# EAGLE design DRIVER (EAGLE 9.5.0)
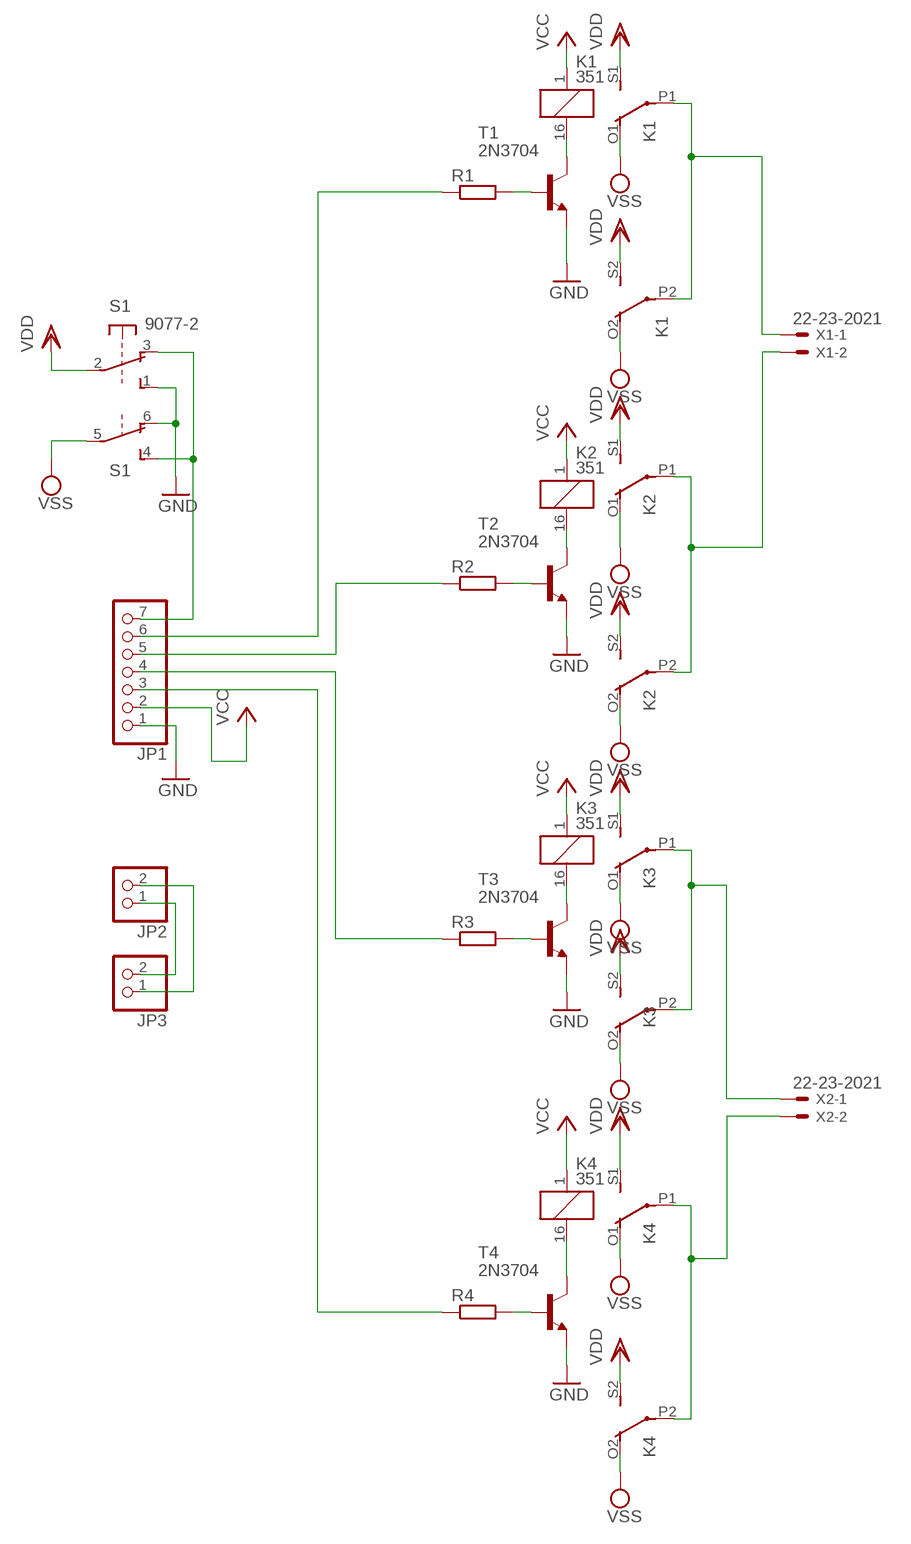
[diagram p0: schematic, sheet 1]

## Parts
JP1  PINHD-1X7  [1X07]
JP2  PINHD-1X2  [1X02]
JP3  PINHD-1X2  [1X02]
K1  351  [351]
K2  351  [351]
K3  351  [351]
K4  351  [351]
R1  R-EU_0207/7  [0207/7]
R2  R-EU_0207/7  [0207/7]
R3  R-EU_0207/7  [0207/7]
R4  R-EU_0207/7  [0207/7]
S1  9077-2  [9077-2]
T1  2N3704  [TO92]
T2  2N3704  [TO92]
T3  2N3704  [TO92]
T4  2N3704  [TO92]
X1  22-23-2021  [22-23-2021]
X2  22-23-2021  [22-23-2021]

## Nets
GND: JP1.1 S1.1(1:S) S1.6(2:O) T1.3(E) T2.3(E) T3.3(E) T4.3(E)
N$1: K1.16 T1.2(C)
N$2: K2.16 T2.2(C)
N$3: K4.16 T4.2(C)
N$4: K3.P1(2:P) K3.P2(3:P) X2.1
N$5: K4.P1(2:P) K4.P2(3:P) X2.2
N$6: K1.P1(2:P) K1.P2(3:P) X1.1
N$7: K2.P1(2:P) K2.P2(3:P) X1.2
N$8: JP1.5 R2.1
N$9: JP1.4 R3.1
N$10: JP1.3 R4.1
N$11: K3.16 T3.2(C)
N$12: R4.2 T4.1(B)
N$13: R3.2 T3.1(B)
N$14: R2.2 T2.1(B)
N$15: R1.2 T1.1(B)
N$16: JP1.6 R1.1
N$17: JP2.2 JP3.1
N$18: JP1.7 S1.3(1:O) S1.4(2:S)
N$19: JP2.1 JP3.2
VCC: JP1.2 K1.1 K2.1 K3.1 K4.1
VDD: K1.S1(2:S) K1.S2(3:S) K2.S1(2:S) K2.S2(3:S) K3.S1(2:S) K3.S2(3:S) K4.S1(2:S) K4.S2(3:S) S1.2(1:P)
VSS: K1.O1(2:O) K1.O2(3:O) K2.O1(2:O) K2.O2(3:O) K3.O1(2:O) K3.O2(3:O) K4.O1(2:O) K4.O2(3:O) S1.5(2:P)

## Library data of the parts
JP1 = pinhead:PINHD-1X7: PIN HEADER
JP2 JP3 = pinhead:PINHD-1X2: PIN HEADER
K1-K4 = relay:351: RELAY 2 x switch, Omron; OC_FARNELL: unknown; OC_NEWARK: unknown
R1-R4 = resistor:R-EU_: RESISTOR, European symbol
S1 = switch-misc:9077-2: MARQUARDT SWITCH 9077.0200 Distributor: Buerklin <https://www.buerklin.com/default.asp?event=ShowArtikel%2812G2822%29&l=d&jump=ArtNr_12G2822>
T1-T4 = transistor:2N3704: NPN TRANSISTOR
X1 X2 = con-molex:22-23-2021: .100" (2.54mm) Center Header - 2 Pin; MF: MOLEX; MPN: 22-23-2021; OC_FARNELL: 1462926; OC_NEWARK: 25C3832

## Board
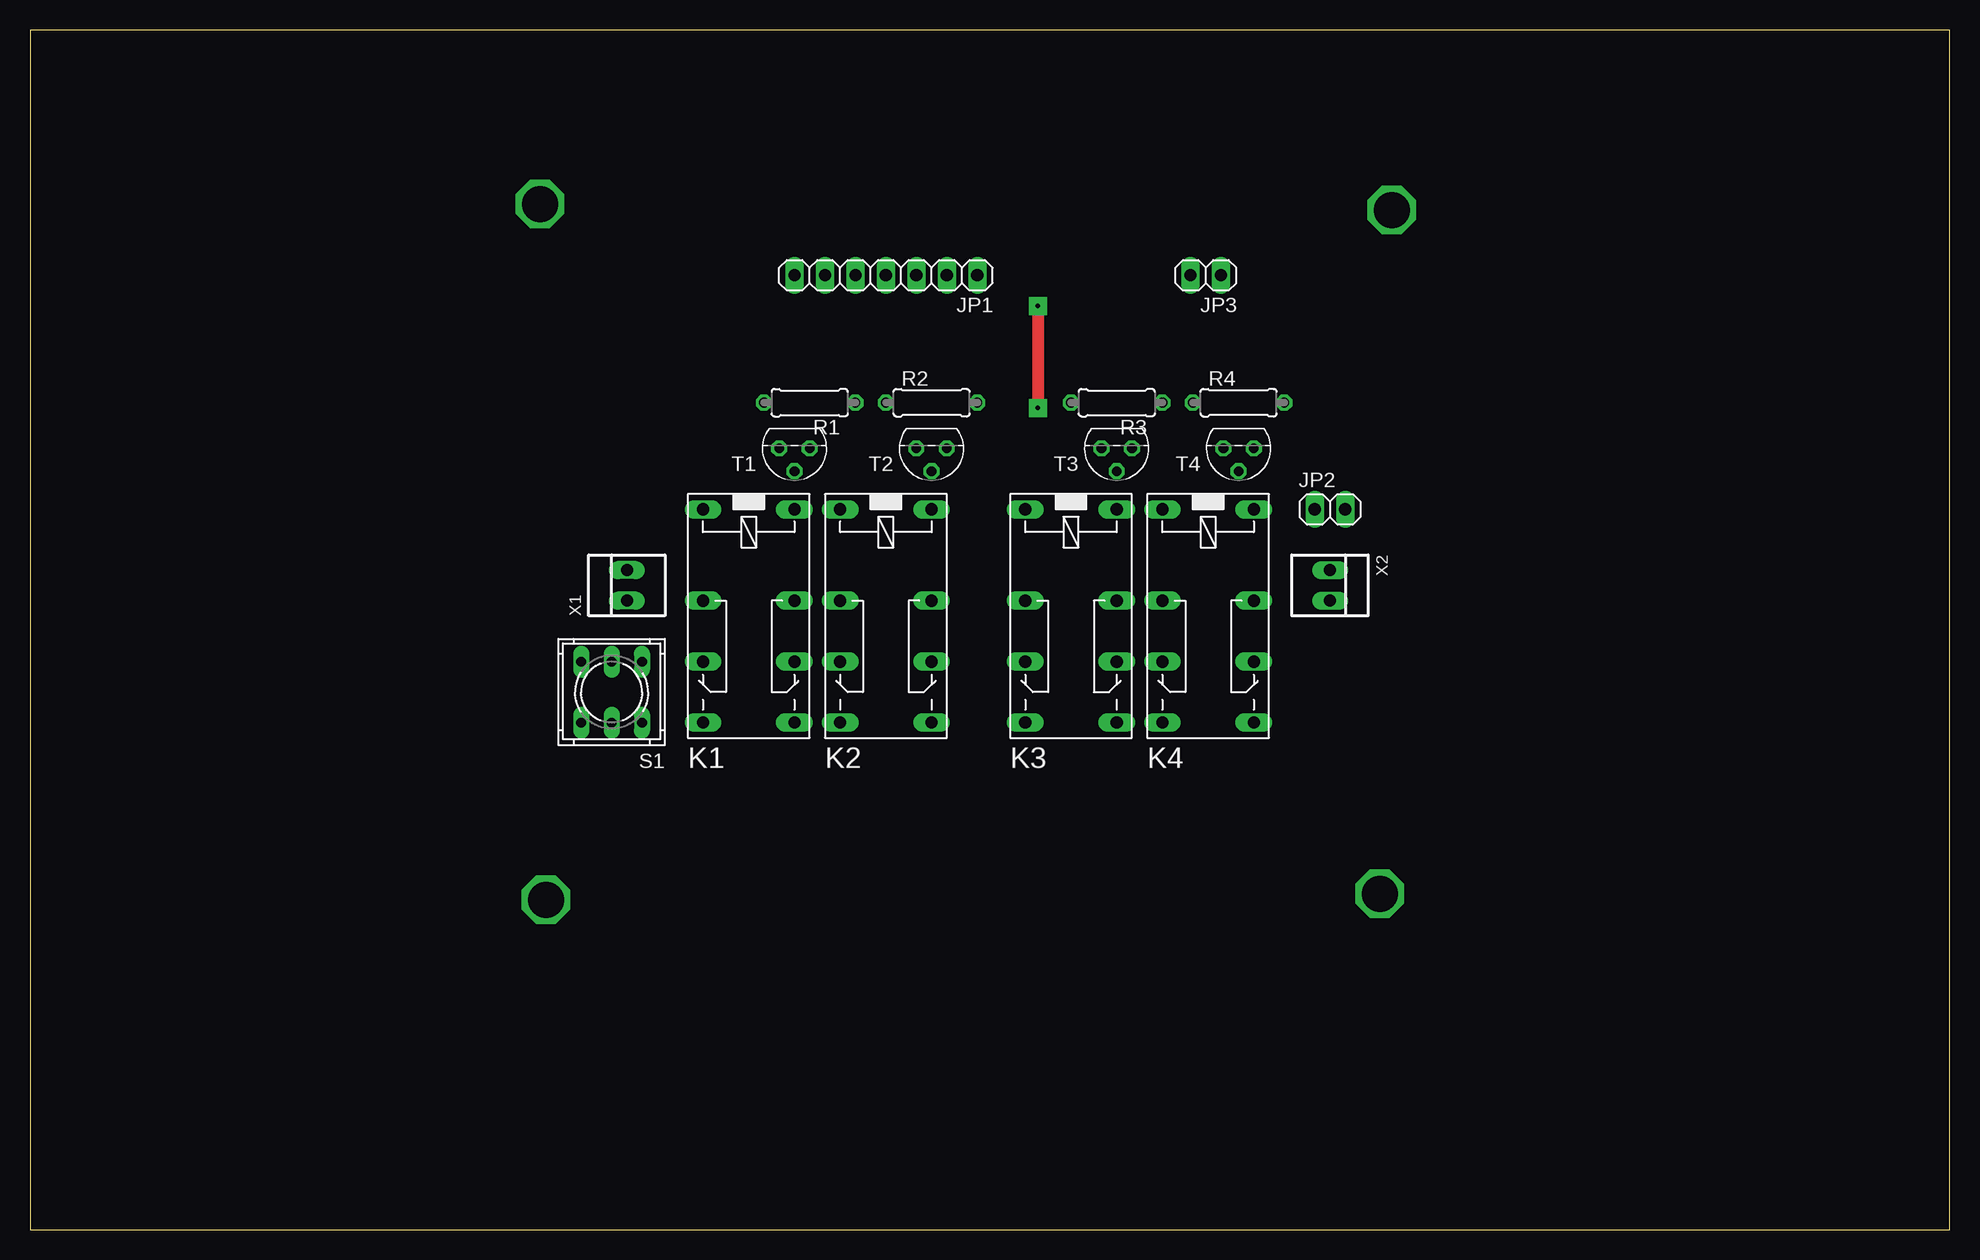
[diagram p1: board, top side]
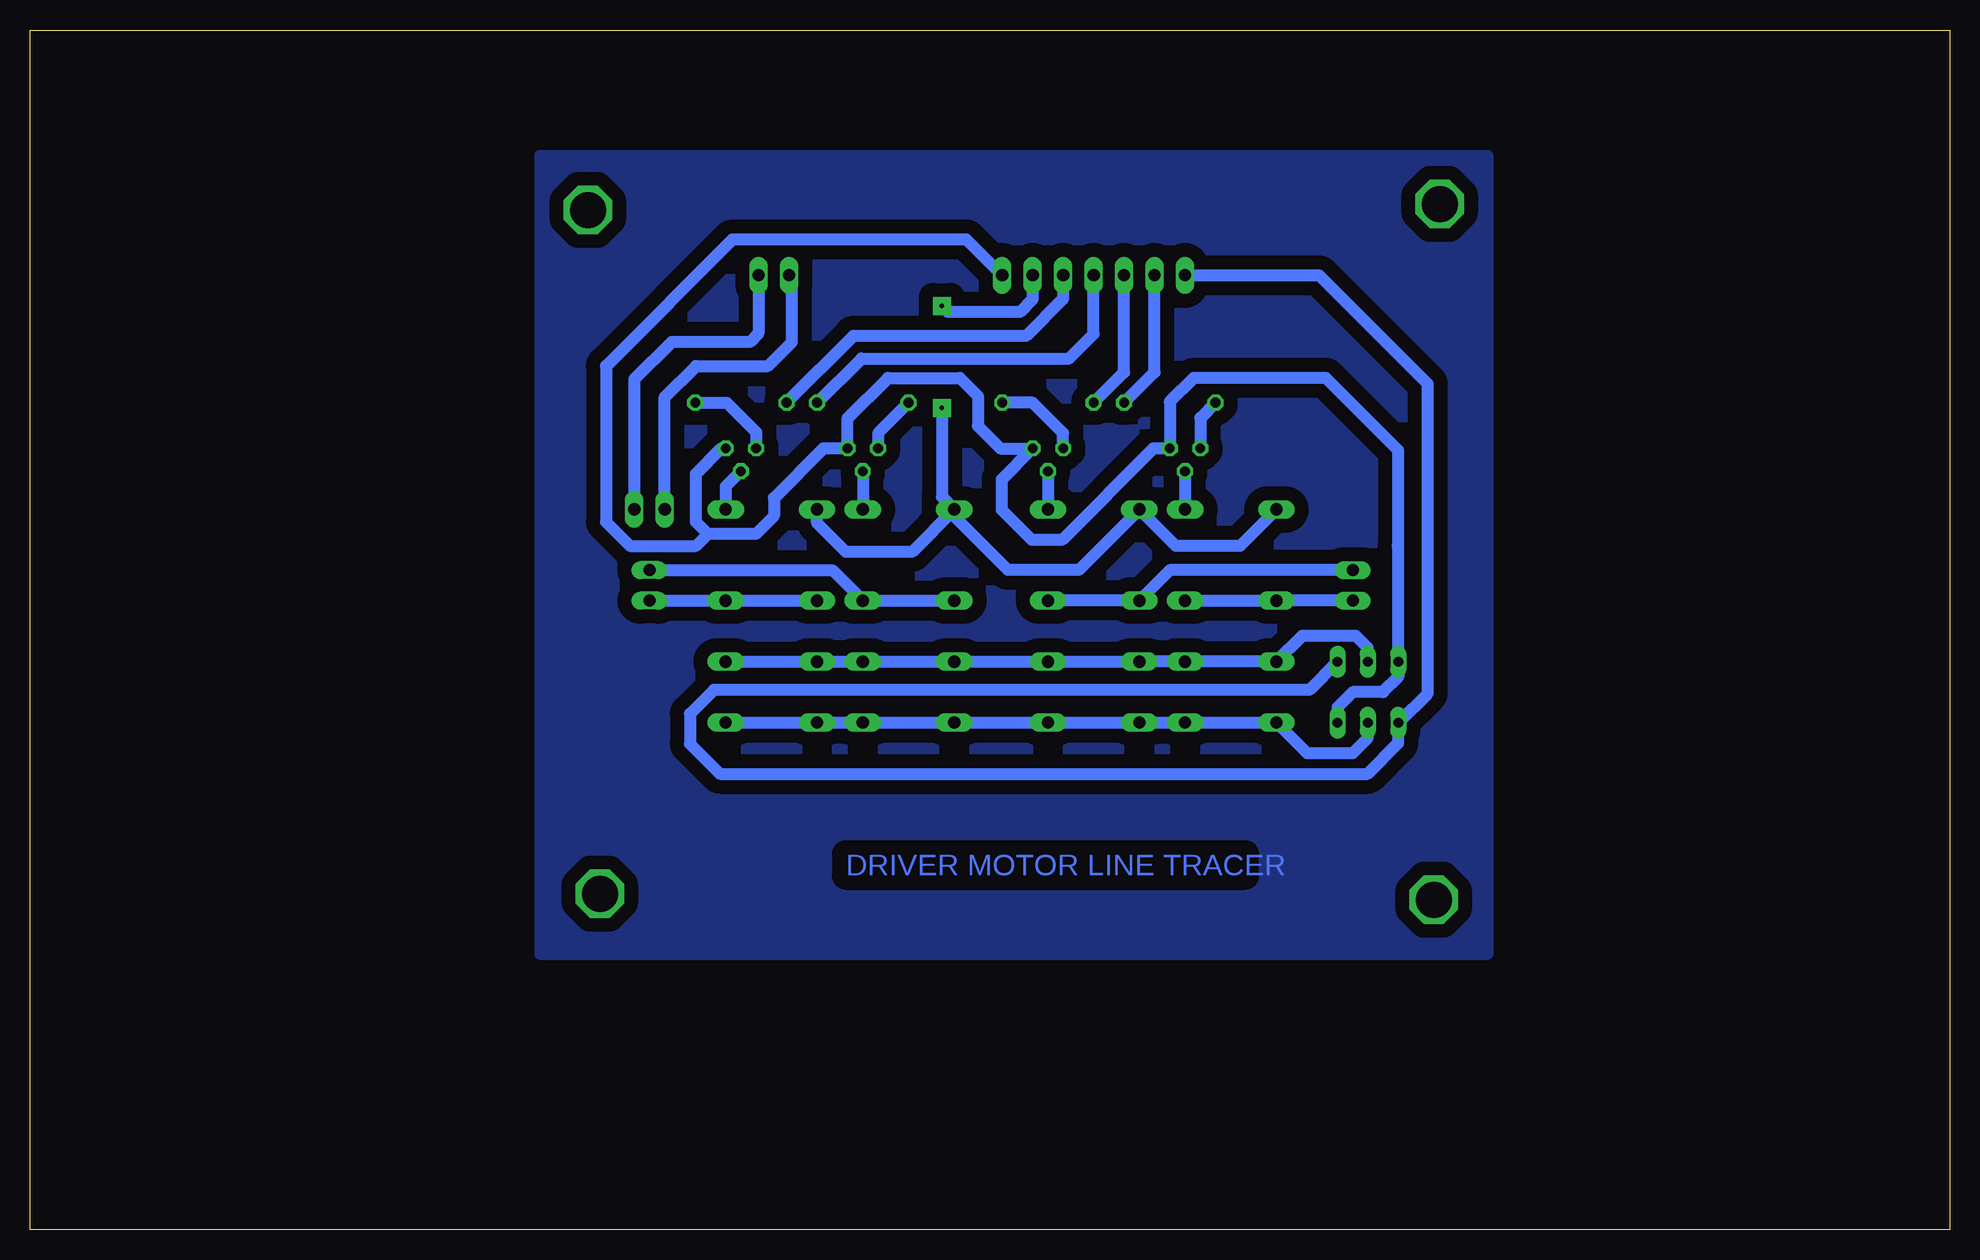
[diagram p2: board, bottom side, seen from below]

Size 160 x 100 mm. Coordinates in mm from the lower left corner, seen from the top.
Outline: 0,0 160,0 160,100 0,100 0,0
Copper layers (1*16): Top 0.035mm / dielectric 1.5mm / Bottom 0.035mm
Design rules "default *": minimum track width 6mil, minimum drill 0.35mm, track to track 46mil, track to pad 46mil, pad to pad 6mil, via to via 6mil, smd to smd 6mil, copper to edge 40mil, drill to drill 6mil, minimum pad ring 10mil, minimum via ring 8mil, stop-mask expansion 4mil, vias tented up to drill 0mil, thermal gap 10mil

### Footprints (pad centres in the part's own frame; a part is rotated, then mirrored left to right if it is on the bottom)
1X07 = drill 1.016 long: 1 -7.62,0; 2 -5.08,0; 3 -2.54,0; 4 0,0; 5 2.54,0; 6 5.08,0; 7 7.62,0
1X02 = drill 1.016 long: 1 -1.27,0; 2 1.27,0
351 = drill 1.016 long: 1 -3.81,-3.81; 16 -3.81,3.81; O1 8.89,-3.81; O2 8.89,3.81; P1 3.81,-3.81; P2 3.81,3.81; S1 13.97,-3.81; S2 13.97,3.81
0207/7 = drill 0.813 octagon: 1 -3.81,0; 2 3.81,0
9077-2 = drill 0.813 long: 1 -2.54,2.54; 2 0,2.54; 3 2.54,2.54; 4 -2.54,-2.54; 5 0,-2.54; 6 2.54,-2.54
TO92 = drill 0.813 octagon: 1 1.27,0; 2 0,1.905; 3 -1.27,0
22-23-2021 = drill 1 long: 1 -1.27,0; 2 1.27,0

### Placement (x,y rotation side)
JP1  71.34,79.55 180 top
JP2  108.36,60.04 0 top
JP3  98.01,79.55 180 top
K1  59.91,56.23 270 top
K2  71.34,56.23 270 top
K3  86.77,56.23 270 top
K4  98.2,56.23 270 top
R1  64.99,68.93 180 top
R2  75.15,68.93 0 top
R3  90.58,68.93 180 top
R4  100.74,68.93 0 top
S1  48.48,44.8 180 top
T1  63.72,65.12 180 top
T2  75.15,65.12 180 top
T3  90.58,65.12 180 top
T4  100.74,65.12 180 top
X1  49.75,53.69 90 top
X2  108.36,53.69 270 top

### Tracks (layer width: path | path; a pad name or v marks a point on that pad's centre or on a via)
GND
  Bottom 1: S1.1 51.02,43.53 49.75,44.8 47.21,44.8 45.94,46.07 S1.6 45.94,56.94 | 45.94,56.94 46,57 | 45.94,56.94 45.94,64.94 52,71 63,71 64.99,69.01 T1.3 66.38,65.12 74,57.5 76.5,57.5 79,60 79,62.54 T2.3 79.12,65.12 81,67 81,69.5 82.5,71 88.5,71 91.85,67.65 T3.3 93.88,65.12 98,61 98,59.5 99.5,58 103.5,58 | 103.5,58 104.5,59 104.5,63 102.38,65.12 T4.3 | JP1.1 81.96,82.55 101.45,82.55 112,72 112,59 110,57 104.5,57 103.5,58
KL
  pour Bottom: 38.5,89.5 117.5,89.5 117.5,23 38.5,23
N$1
  Bottom 1: T1.2 K1.16
N$2
  Bottom 1: T2.2 K2.16
N$3
  Bottom 1: T4.2 102.01,61.95 K4.16
N$4
  Bottom 1: X2.1 93.12,54.96 K3.P2 K3.P1
N$5
  Bottom 1: X2.2 K4.P2 K4.P1
N$6
  Bottom 1: X1.1 K1.P1 K1.P2
N$7
  Bottom 1: X1.2 64.99,54.96 K2.P1 K2.P2
N$8
  Bottom 1: R2.1 68.8,71.47 JP1.5
N$9
  Bottom 1: R3.1 90.7,72.62 73.38,72.62 71.34,74.66 JP1.4
N$10
  Bottom 1: JP1.3 73.88,77.62 77,74.5 91.36,74.5 R4.1
N$11
  Bottom 1: T3.2 K3.16
N$12
  Bottom 1: R4.2 101.93,68.93 99.47,66.47 T4.1
N$13
  Bottom 1: R3.2 89.31,66.39 T3.1
N$14
  Bottom 1: T2.1 73.88,66.38 76.43,68.93 R2.2
N$15
  Bottom 1: R1.2 62.45,67.66 T1.1
N$16
  Bottom 1: R1.1 66.26,71.47 JP1.6
N$17
  Bottom 1: JP3.1 99.28,74.72 100,74 106.5,74 109.63,70.87 JP2.2
N$18
  Bottom 1: S1.4 53.36,45 103,45 105,43 105,40.5 102.5,38 48.5,38 45.94,40.56 S1.3 43.5,44.7 43.5,70.5 52.55,79.55 JP1.7
N$19
  Bottom 1: JP2.1 107.09,69.41 104.5,72 98.5,72 96.5,74 96.5,79.31 JP3.2
N$20  (via drill 3 pad 4)
  other vias: 42.5,85.5
N$21  (via drill 3 pad 4)
  other vias: 113.5,85
N$22  (via drill 3 pad 4)
  other vias: 112.5,28
N$23  (via drill 3 pad 4)
  other vias: 43,27.5
VCC  (via drill 0.35 pad 1.5)
  Top 1: v84,77 v84,68.5
  Bottom 1: K1.1 59.14,57 64.5,57 K2.1 72.57,55 78.5,55 82.96,59.46 K3.1 | K3.1 86.5,56.5 92,56.5 94.39,58.89 K4.1 | JP1.2 76.42,77.58 77.5,76.5 83.5,76.5 v84,77 | v84,68.5 84,61.08 K3.1
VDD
  Bottom 1: K4.S2 K4.S1 K3.S2 K3.S1 K2.S2 K2.S1 K1.S2 K1.S1 53.56,39.72 49.75,39.72 48.48,40.99 S1.2
VSS
  Bottom 1: S1.5 48.48,48.48 49.5,49.5 53.94,49.5 K1.O1 K1.O2 K2.O1 K2.O2 K3.O1 K3.O2 K4.O1 K4.O2

### Text on the board
Bottom: DRIVER MOTOR LINE TRACER